# EAGLE schematic dimmer230 (EAGLE 4.16)
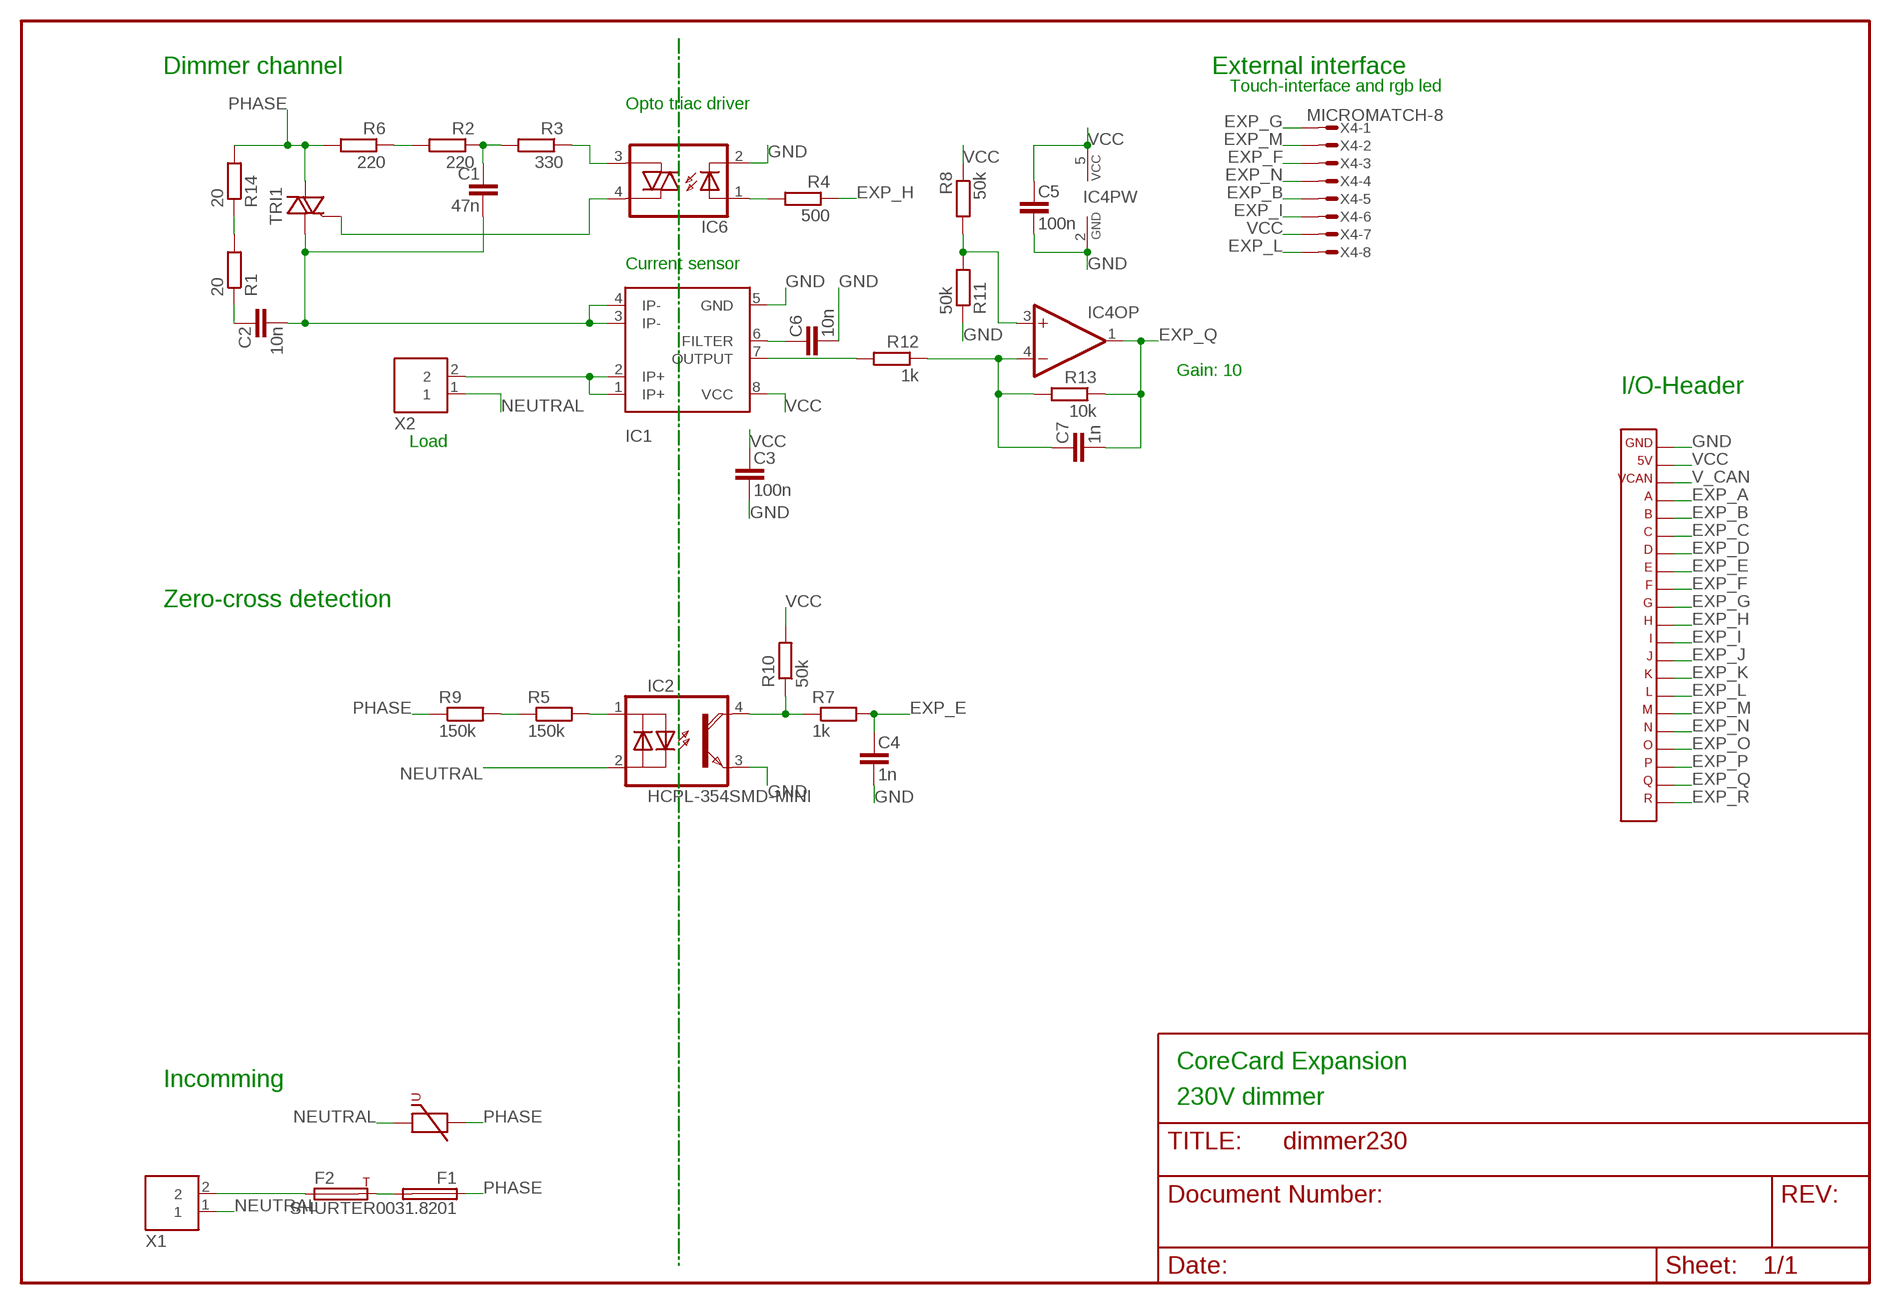
[diagram p0: schematic, sheet 1]

## Parts
C1  47n  C-EUC102-04313  [C102-04313]
C2  10n  C-EUC102-04313  [C102-04313]
C3  100n  C-EUC0603  [C0603]
C4  1n  C-EUC0603  [C0603]
C5  100n  C-EUC0603  [C0603]
C6  10n  C-EUC0603  [C0603]
C7  1n  C-EUC0603  [C0603]
F1  SHURTER0031.8201  [22.5]
F2  G4APHT  [PHT]
IC1  ACS712SOIC  [SOIC]
IC2  HCPL-354SMD-MINI  [SMD-MINI]
IC4  NCS2001SQ2T2SOT23-5  [SOT23-5]
IC6  S2S3ADYFSMD  [SMD]
R1  20  R-EUR1206  [R1206]
R2  220  R-EUR1206  [R1206]
R3  330  R-EUR1206  [R1206]
R4  500  R-EUR0603  [R0603]
R5  150k  R-EUR1206  [R1206]
R6  220  R-EUR1206  [R1206]
R7  1k  R-EUR0603  [R0603]
R8  50k  R-EUR0603  [R0603]
R9  150k  R-EUR1206  [R1206]
R10  50k  R-EUR0603  [R0603]
R11  50k  R-EUR0603  [R0603]
R12  1k  R-EUR0603  [R0603]
R13  10k  R-EUR0603  [R0603]
R14  20  R-EUR1206  [R1206]
TRI1  BTA204SDPAK  [DPAK]
V1  VC32SMD  [SMD]
X1  BLOCK25.08  [PCB2_5.08]
X2  BLOCK25.08  [PCB2_5.08]
X3  CORE_IOHEADEXP  [CORE_IOHEAD_NOSILC]
X4  MICROMATCH-8  [MICROMATCH-8]

## Nets
CUR_DIV: IC4.3(OP:+IN) R8.2 R11.2
CUR_OUTP: IC1.7(OUTPUT) R12.2
EXP_A: X3.4
EXP_B: X3.5 X4.5
EXP_C: X3.6
EXP_D: X3.7
EXP_E: C4.1 R7.2 X3.8
EXP_F: X3.9 X4.3
EXP_G: X3.10 X4.1
EXP_H: R4.1 X3.11
EXP_I: X3.12 X4.6
EXP_J: X3.13
EXP_K: X3.14
EXP_L: X3.15 X4.8
EXP_M: X3.16 X4.2
EXP_N: X3.17 X4.4
EXP_O: X3.18
EXP_P: X3.19
EXP_Q: C7.2 IC4.1(OP:OUT) R13.1 X3.20
EXP_R: X3.21
FILT: C6.1 IC1.6(FILTER)
GATE1: IC6.4(A2) TRI1.3(G)
GND: C3.2 C4.2 C5.2 C6.2 IC1.5(GND) IC2.3(E) IC4.2(PW:GND) IC6.2(C) R11.1 X3.1
IP+: IC1.1(IP+) IC1.2(IP+) X2.2
IP-: C1.2 C2.2 IC1.3(IP-) IC1.4(IP-) TRI1.1(T1)
N$1: IC6.3(A1) R3.1
N$2: C1.1 R2.1 R3.2
N$3: IC2.1(A) R5.2
N$4: IC6.1(A) R4.2
N$5: IC2.4(COL) R7.1 R10.1
N$7: C2.1 R1.1
N$9: R5.1 R9.2
N$10: R2.2 R6.1
N$11: R1.2 R14.1
NEUTRAL: IC2.2(C) V1.P$1 X1.1 X2.1
OP_NEG: C7.1 IC4.4(OP:-IN) R12.1 R13.2
PHASE: F1.P$1 R6.2 R9.1 R14.2 TRI1.MB(T2) V1.P$2
THERMAL_FUSED: F1.P$2 F2.P$2
UNFUSED_PHASE: F2.P$1 X1.2
V_CAN: X3.3
VCC: C3.1 C5.1 IC1.8(VCC) IC4.5(PW:VCC) R8.1 R10.2 X3.2 X4.7

## Notes on the sheet
- Dimmer channel | External interface
- Touch-interface and rgb led
- Opto triac driver
- Current sensor
- Gain: 10
- I/O-Header
- Load
- Zero-cross detection
- CoreCard Expansion
- Incomming
- 230V dimmer

## Library data of the parts
C1-C7 = rcl:C-EU
F1 = fuseholder_schurter:SHURTER0031.8201
F2 = thermofuse-g4a:G4A
IC1 = ACS712:ACS712
IC2 = optocoupler_hcpl-354:HCPL-354
IC4 = NCS2001:NCS2001SQ2T2
IC6 = optocoupler-S2S3ADYF:S2S3ADYF
R1-R14 = rcl:R-EU
TRI1 = triac:BTA204S
V1 = varistor_VC32:VC32
X1 X2 = terminal_block:BLOCK2
X3 = expboard:CORE_IOHEAD: CoreCard IO-header for expansion cards
X4 = con-amp-micromatch:MICROMATCH-8: MicroMaTch 8 7-215464-8 / 0-215464-8 Drawing Number C-215464 DDEController.pdf